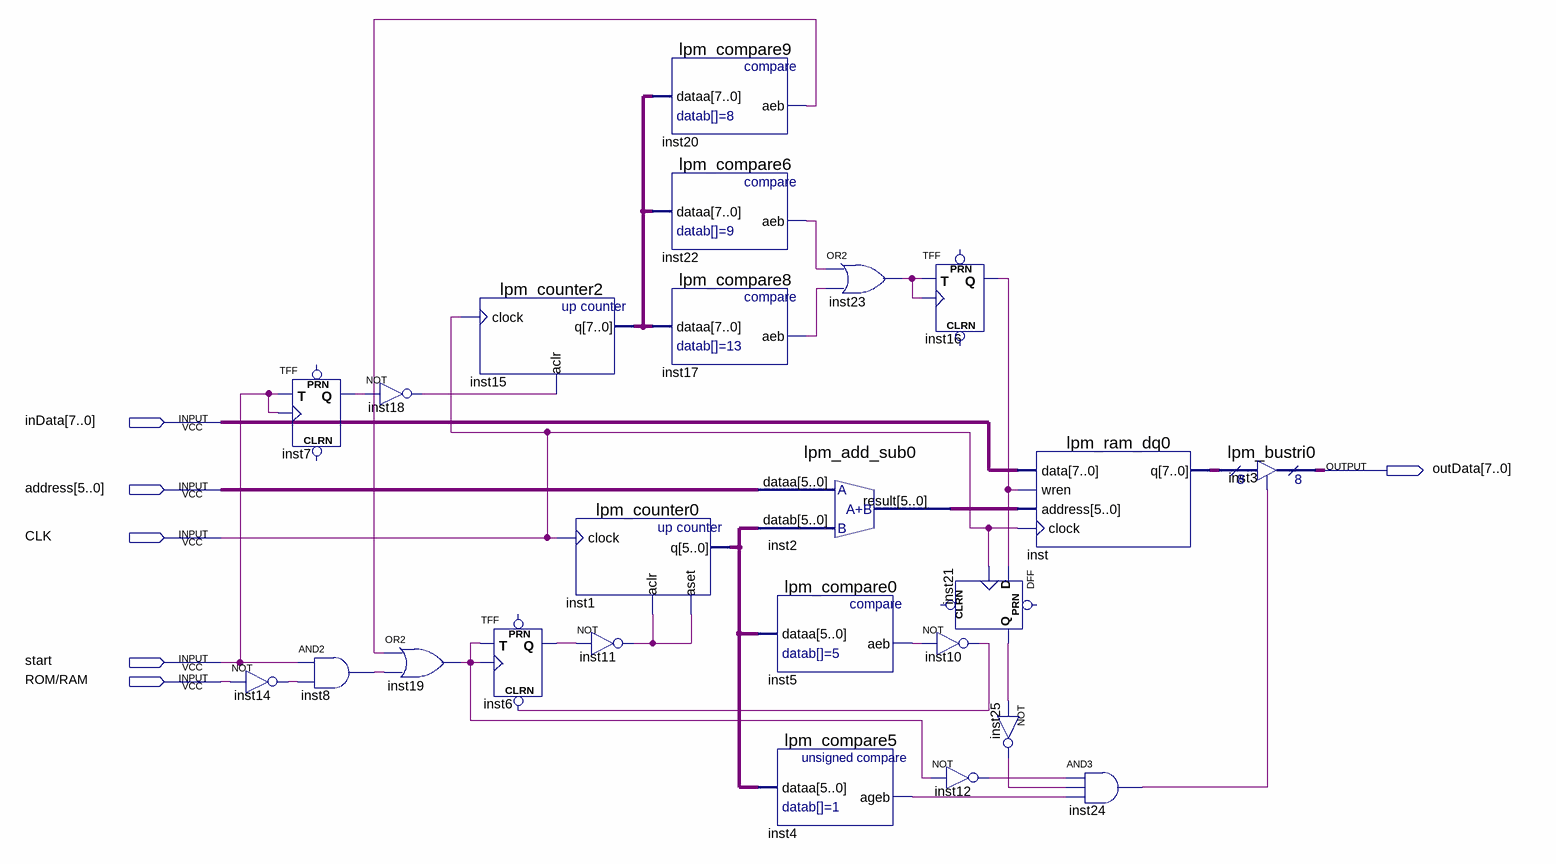
[diagram p0: schematic sheet]
// Quartus schematic RAM.bdf as structural Verilog: 24 symbols, 6 pins
module RAM (
  input  [7:0] inData,
  input  [5:0] address,
  input  CLK,
  input  start,
  input  \ROM/RAM ,
  output [7:0] outData
);

  wire inst4_ageb, inst5_aeb, inst6_q, inst7_q, inst8_out, inst10_out, inst11_out, inst12_out, inst14_out,
       inst16_q, inst17_aeb, inst18_out, inst19_out, inst20_aeb, inst21_q, inst22_aeb, inst23_out,
       inst24_out, inst25_out;
  wire [5:0] inst1_q, inst2_result;
  wire [7:0] inst15_q, inst_q;

  not inst14 (inst14_out, \ROM/RAM );
  TFF inst7 (.T(start), .CLK(start), .Q(inst7_q));  // open: PRN, CLRN
  and inst8 (inst8_out, start, inst14_out);
  not inst18 (inst18_out, inst7_q);
  or inst19 (inst19_out, inst20_aeb, inst8_out);
  lpm_counter2 inst15 (.clock(CLK), .aclr(inst18_out), .q(inst15_q));
  TFF inst6 (.CLRN(inst10_out), .T(inst19_out), .CLK(inst19_out), .Q(inst6_q));  // open: PRN
  lpm_counter0 inst1 (.clock(CLK), .aclr(inst11_out), .aset(inst11_out), .q(inst1_q));
  not inst11 (inst11_out, inst6_q);
  lpm_compare9 inst20 (.dataa(inst15_q), .aeb(inst20_aeb));
  lpm_compare6 inst22 (.dataa(inst15_q), .aeb(inst22_aeb));
  lpm_compare8 inst17 (.dataa(inst15_q), .aeb(inst17_aeb));
  lpm_add_sub0 inst2 (.dataa(address), .datab(inst1_q), .result(inst2_result));
  lpm_compare0 inst5 (.dataa(inst1_q), .aeb(inst5_aeb));
  lpm_compare5 inst4 (.dataa(inst1_q), .ageb(inst4_ageb));
  or inst23 (inst23_out, inst22_aeb, inst17_aeb);
  TFF inst16 (.T(inst23_out), .CLK(inst23_out), .Q(inst16_q));  // open: PRN, CLRN
  DFF inst21 (.CLK(CLK), .D(inst16_q), .Q(inst21_q));  // open: CLRN, PRN
  not inst10 (inst10_out, inst5_aeb);
  not inst12 (inst12_out, inst19_out);
  lpm_ram_dq0 inst (.data(inData), .wren(inst16_q), .address(inst2_result), .clock(CLK), .q(inst_q));
  not inst25 (inst25_out, inst21_q);
  and inst24 (inst24_out, inst12_out, inst25_out, inst4_ageb);
  lpm_bustri0 inst3 (.enabledt(inst24_out), .data(inst_q), .tridata(outData));
endmodule
